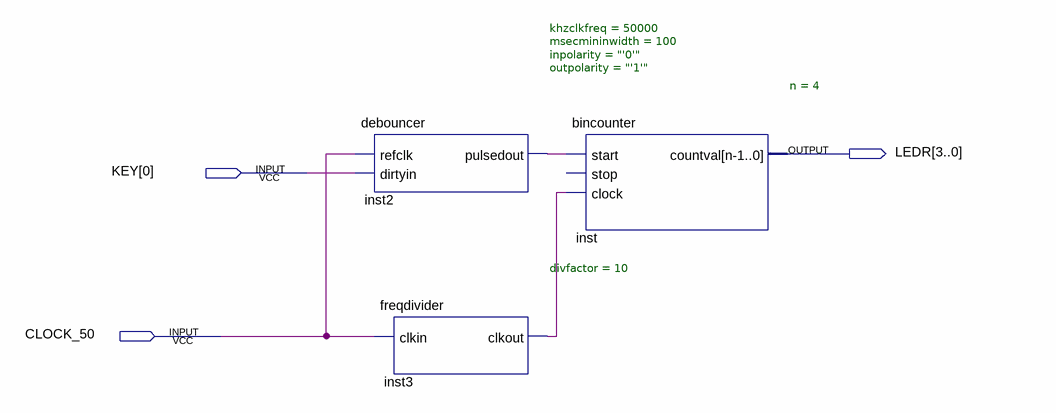
[diagram p0: schematic sheet]
// Quartus schematic TmpDesop.bdf as structural Verilog: 3 symbols, 3 pins
module TmpDesop (
  input  [0:0] KEY,
  input  CLOCK_50,
  output [3:0] LEDR
);

  wire inst2_pulsedout, inst3_clkout;

  debouncer #(.khzclkfreq(50000), .msecmininwidth(100), .inpolarity("'0'"), .outpolarity("'1'")) inst2 (
    .refclk(CLOCK_50), .dirtyin(KEY[0]), .pulsedout(inst2_pulsedout));
  freqdivider #(.divfactor(10)) inst3 (.clkin(CLOCK_50), .clkout(inst3_clkout));
  bincounter #(.n(4)) inst (.start(inst2_pulsedout), .clock(inst3_clkout), .countval(LEDR));  // open: stop
endmodule
